# Altium schematic sheet MCU.SchDoc
size A; SheetNumber: 2; SheetTotal: 10
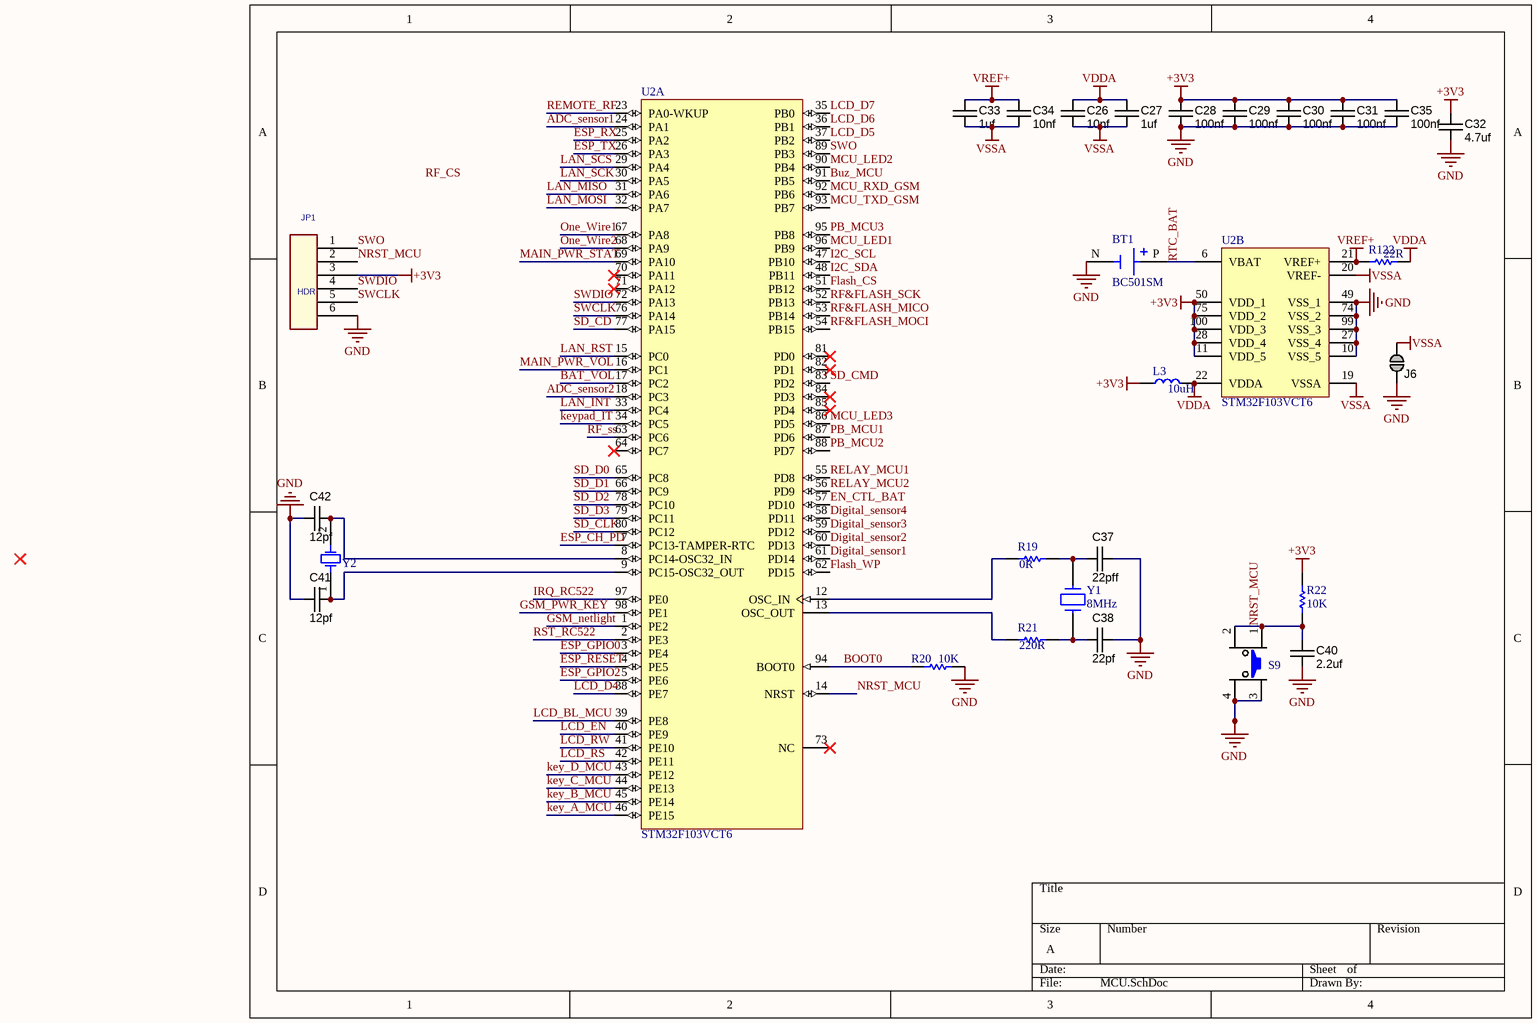
[diagram p0: MCU.SchDoc]

## Parts
BT1  BC501SM  [BAT_BC501SM]
C26  10nf  [CAPC1608X90N]
C27  1uf  [CAPC1608X90N]
C28  100nf  [CAPC1608X90N]
C29  100nf  [CAPC1608X90N]
C30  100nf  [CAPC1608X90N]
C31  100nf  [CAPC1608X90N]
C32  4.7uf  [CAPC1608X90N]
C33  1uf  [CAPC1608X90N]
C34  10nf  [CAPC1608X90N]
C35  100nf  [CAPC1608X90N]
C37  22pff  [CAPC1608X90N]
C38  22pf  [CAPC1608X90N]
C40  2.2uf  [CAPC1608X90N]
C41  12pf  [CAPC1608X90N]
C42  12pf  [CAPC1608X90N]
J6  Jumper  [JUMP1]  (value not drawn)  (no BOM)
JP1  HDR  [HDR_1x6]
L3  10uH  [L0805]
R19  0R  [Resistor_SMD_0603 (1608)]
R20  10K  [Resistor_SMD_0603 (1608)]
R21  220R  [Resistor_SMD_0603 (1608)]
R22  10K  [Resistor_SMD_0603 (1608)]
R122  22R  [Resistor_SMD_0603 (1608)]
S9  SW_PB4 SMD  [SMD_PB]  (value not drawn)
U2  STM32F103VCT6  [STM-LQFP100_L]  (parts A,B of 2)
Y1  8MHz  [My_Crystal - SMD]
Y2  32.768KHz  [Crystal Clock RIGHT 3]  (value not drawn)

## Nets
+3V3: C28.2 C29.2 C30.2 C31.2 C32.2 C35.2 JP1.3 L3.1 R22.1 U2.11(VDD_5) U2.28(VDD_4) U2.50(VDD_1) U2.75(VDD_2) U2.100(VDD_3)
GND: BT1.N(NEG) C28.1 C29.1 C30.1 C31.1 C32.1 C35.1 C37.2 C38.2 C40.2 C41.2 C42.2 J6.1 JP1.6 R20.2 S9.3 S9.4 U2.10(VSS_5) U2.27(VSS_4) U2.49(VSS_1) U2.74(VSS_2) U2.99(VSS_3)
VDDA: C26.2 C27.2 L3.2 R122.1 U2.22(VDDA)
VREF+: C33.2 C34.2 R122.2 U2.21(VREF+)
VSSA: C26.1 C27.1 C33.1 C34.1 J6.2 U2.19(VSSA) U2.20(VREF-)
ADC_sensor1: U2.24(PA1)
ADC_sensor2: U2.18(PC3)
BAT_VOL: U2.17(PC2)
BOOT0: R20.1 U2.94(BOOT0)
Buz_MCU: U2.91(PB5)
Digital_sensor1: U2.61(PD14)
Digital_sensor2: U2.60(PD13)
Digital_sensor3: U2.59(PD12)
Digital_sensor4: U2.58(PD11)
EN_CTL_BAT: U2.57(PD10)
ESP_CH_PD: U2.7(PC13-TAMPER-RTC)
ESP_GPIO0: U2.3(PE4)
ESP_GPIO2: U2.5(PE6)
ESP_RESET: U2.4(PE5)
ESP_RX: U2.25(PA2)
ESP_TX: U2.26(PA3)
Flash_CS: U2.51(PB12)
Flash_WP: U2.62(PD15)
GSM_netlight: U2.1(PE2)
GSM_PWR_KEY: U2.98(PE1)
I2C_SCL: U2.47(PB10)
I2C_SDA: U2.48(PB11)
IRQ_RC522: U2.97(PE0)
key_A_MCU: U2.46(PE15)
key_B_MCU: U2.45(PE14)
key_C_MCU: U2.44(PE13)
key_D_MCU: U2.43(PE12)
keypad_IT: U2.34(PC5)
LAN_INT: U2.33(PC4)
LAN_MISO: U2.31(PA6)
LAN_MOSI: U2.32(PA7)
LAN_RST: U2.15(PC0)
LAN_SCK: U2.30(PA5)
LAN_SCS: U2.29(PA4)
LCD_BL_MCU: U2.39(PE8)
LCD_D4: U2.38(PE7)
LCD_D5: U2.37(PB2)
LCD_D6: U2.36(PB1)
LCD_D7: U2.35(PB0)
LCD_EN: U2.40(PE9)
LCD_RS: U2.42(PE11)
LCD_RW: U2.41(PE10)
MAIN_PWR_STAT: U2.69(PA10)
MAIN_PWR_VOL: U2.16(PC1)
MCU_LED1: U2.96(PB9)
MCU_LED2: U2.90(PB4)
MCU_LED3: U2.86(PD5)
MCU_RXD_GSM: U2.92(PB6)
MCU_TXD_GSM: U2.93(PB7)
NRST_MCU: C40.1 JP1.2 R22.2 S9.1 S9.2 U2.14(NRST)
One_Wire1: U2.67(PA8)
One_Wire2: U2.68(PA9)
PB_MCU1: U2.87(PD6)
PB_MCU2: U2.88(PD7)
PB_MCU3: U2.95(PB8)
RELAY_MCU1: U2.55(PD8)
RELAY_MCU2: U2.56(PD9)
REMOTE_RF: U2.23(PA0-WKUP)
RF&FLASH_MICO: U2.53(PB14)
RF&FLASH_MOCI: U2.54(PB15)
RF&FLASH_SCK: U2.52(PB13)
RF_ss: U2.63(PC6)
RST_RC522: U2.2(PE3)
RTC_BAT: BT1.P(POS) U2.6(VBAT)
SD_CD: U2.77(PA15)
SD_CLK: U2.80(PC12)
SD_CMD: U2.83(PD2)
SD_D0: U2.65(PC8)
SD_D1: U2.66(PC9)
SD_D2: U2.78(PC10)
SD_D3: U2.79(PC11)
SWCLK: JP1.5 U2.76(PA14)
SWDIO: JP1.4 U2.72(PA13)
SWO: JP1.1 U2.89(PB3)
NetC37_1: C37.1 R19.2 Y1.2
NetC38_1: C38.1 R21.2 Y1.1
NetC41_1: C41.1 U2.9(PC15-OSC32_OUT) Y2.1
NetC42_1: C42.1 U2.8(PC14-OSC32_IN) Y2.2
NetR19_1: R19.1 U2.12(OSC_IN)
NetR21_1: R21.1 U2.13(OSC_OUT)

Not connected (* = marked no-connect by the designer): U2 64(PC7)* 70(PA11)* 71(PA12)* 73(NC)* 81(PD0)* 82(PD1)* 84(PD3)* 85(PD4)*

## Notes on the sheet
- Labels drawn without touching a wire or pin: RF_CS

## Library data of the parts
BT1 = BC501SM: BATTERY HOLDER COIN 12MM SMD; MF: MPD; SnapEDA_Link: https://www.snapeda.com/parts/BC501SM/MPD/view-part/?ref=snap; Package: None; MP: BC501SM; Price: None; Availability: Unavailable; Check_prices: https://www.snapeda.com/parts/BC501SM/MPD/view-part/?ref=eda; Value: *
C26-C35 C37 C38 C40-C42 = CAPC_100n_0603_X7R_50V_10%: Capacitor SMD Cer 100nF 10% 50V X7R 0603; Manufacturer 1: AVX Corporation; Manufacturer Part Number 1: 06035C104KAT2A; Ratings: 50V; X7R; Material: ceramic; SCDType: spec; Value: 100n; Manufacturer 2: TDK Corporation; Manufacturer Part Number 2: C1608X7R1H104K; Package / Case: 0603 (1608 Metric); Tolerance: ±10%; Supplier 1: Digi-Key; Supplier Part Number 1: 478-5052-1-ND; ComponentLink1URL: http://www.avx.com/docs/Catalogs/cx7r.pdf; ComponentLink1Description: http://www.avx.com/docs/Catalogs/cx7r.pdf; Supplier 2: Digi-Key; Supplier Part Number 2: 445-1314-1-ND; ComponentLink2URL: http://product.tdk.com/capacitor/mlcc/en/documents/mlcc_commercial_general_en.pdf; ComponentLink2Description: http://product.tdk.com/capacitor/mlcc/en/documents/mlcc_commercial_general_en.pdf
J6 = JUMP1: SMD jumper
JP1 = Header 1x6: header or jumper box; DESIGNER: ABBAS BASEREH
L3 = Inductor SMD NC 0805: Value: 1uH; DatasheetVersion: 2022; ComponentLink1Description: Tarahiboard; ComponentLink1URL: https://www.tarahiboard.com/product/library-pack
R19 R21 R122 = Resistor: Resistor 0603; Email: razi.vesali@gmail.com; Value: 10k; Published: 17-Jun-2016; LatestRevisionNote: Re-released for puplic; Publisher: Seyed Razi Vesali
R20 R22 = Resistor: Resistor 0603; Email: razi.vesali@gmail.com; Published: 17-Jun-2016; LatestRevisionNote: Re-released for puplic; Publisher: Seyed Razi Vesali; Value: 10k
U2 = STM32F103VCT6: ARM Cortex-M3 32-bit MCU, 256 KB Flash, 48 KB Internal RAM, 80 I/Os, 100-pin LQFP, -40 to 85 degC, Tray; ComponentLink1Description: Website: Tarahiboard; ComponentLink1URL: https://www.tarahiboard.com
Y1 = CRYSTAL_SMD: Crystal
Y2 = Crystal RTC: Crystal; ComponentLink1Description: Website: Tarahiboard; ComponentLink1URL: https://www.tarahiboard.com/product/library-pack; DatasheetVersion: 2022
S9 = SW_PB4 SMD: ComponentLink1Description: Website Smart World; ComponentLink1URL: https://www.smartw.ir/; ComponentLink2Description: Telegram; ComponentLink2URL: https://t.me/altium_smartw; ComponentLink3Description: Instagram; ComponentLink3URL: https://Instagram.com/smartgw.ir; DatasheetVersion: 2021